# EAGLE board HotFireBoard (EAGLE 9.0.1), part 1 of 2
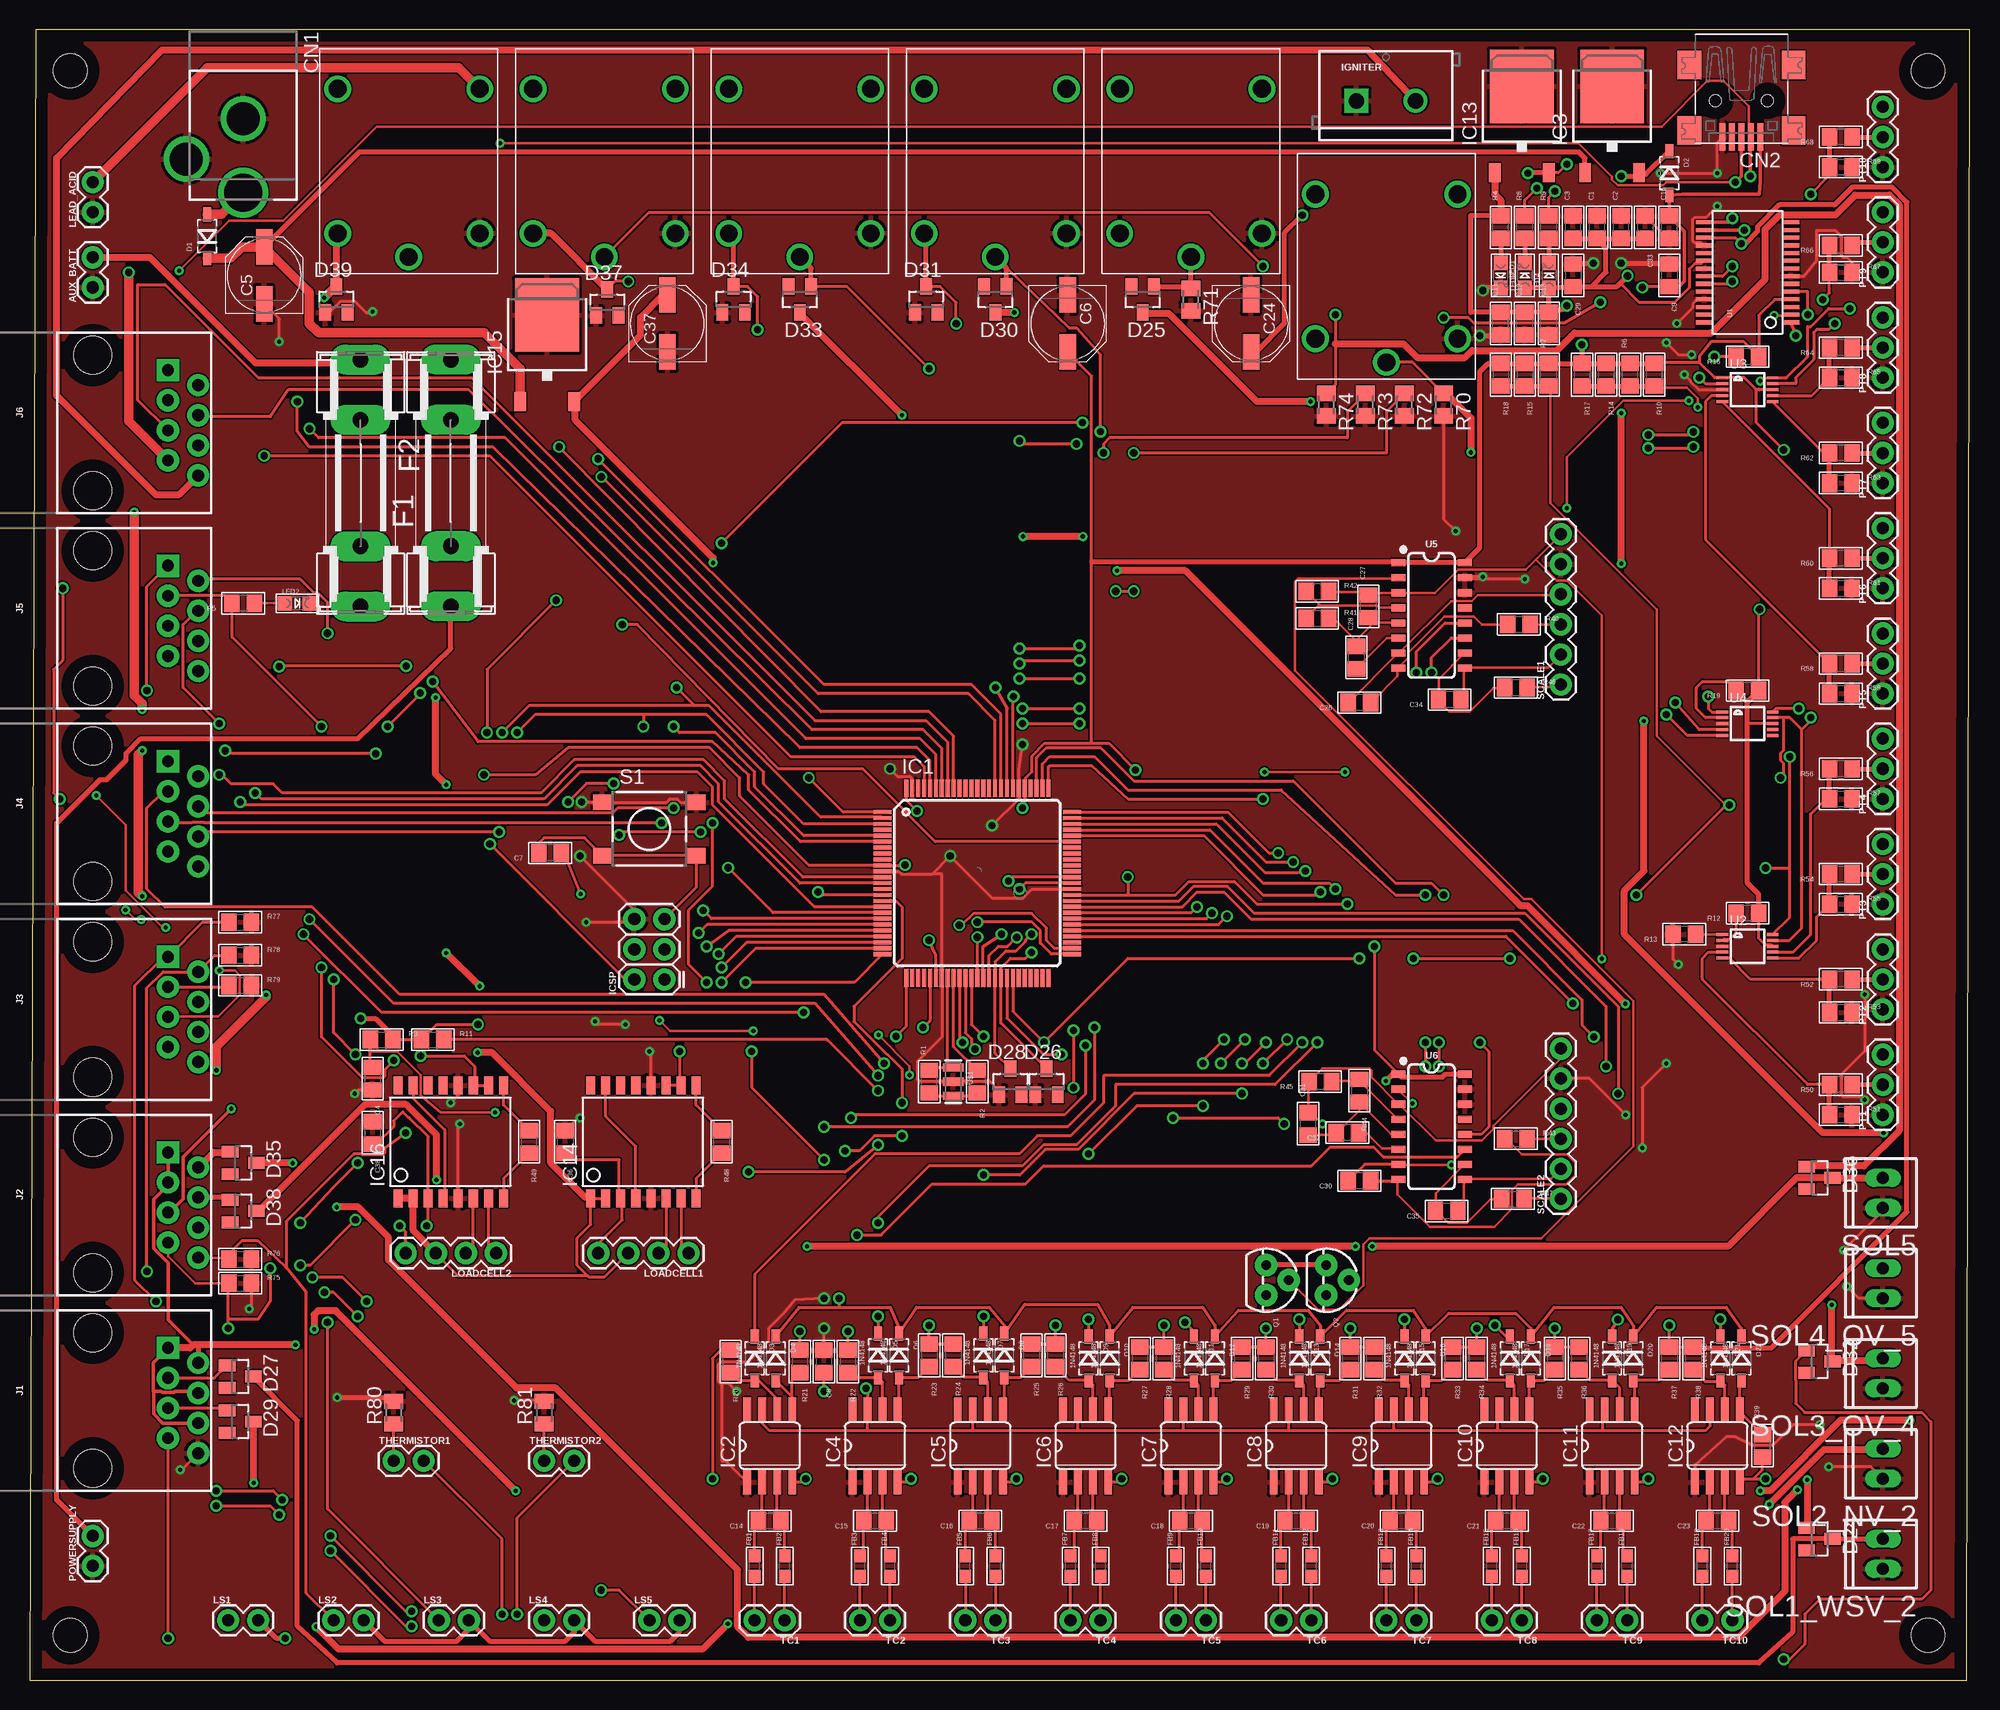
[diagram p2: board, top side]
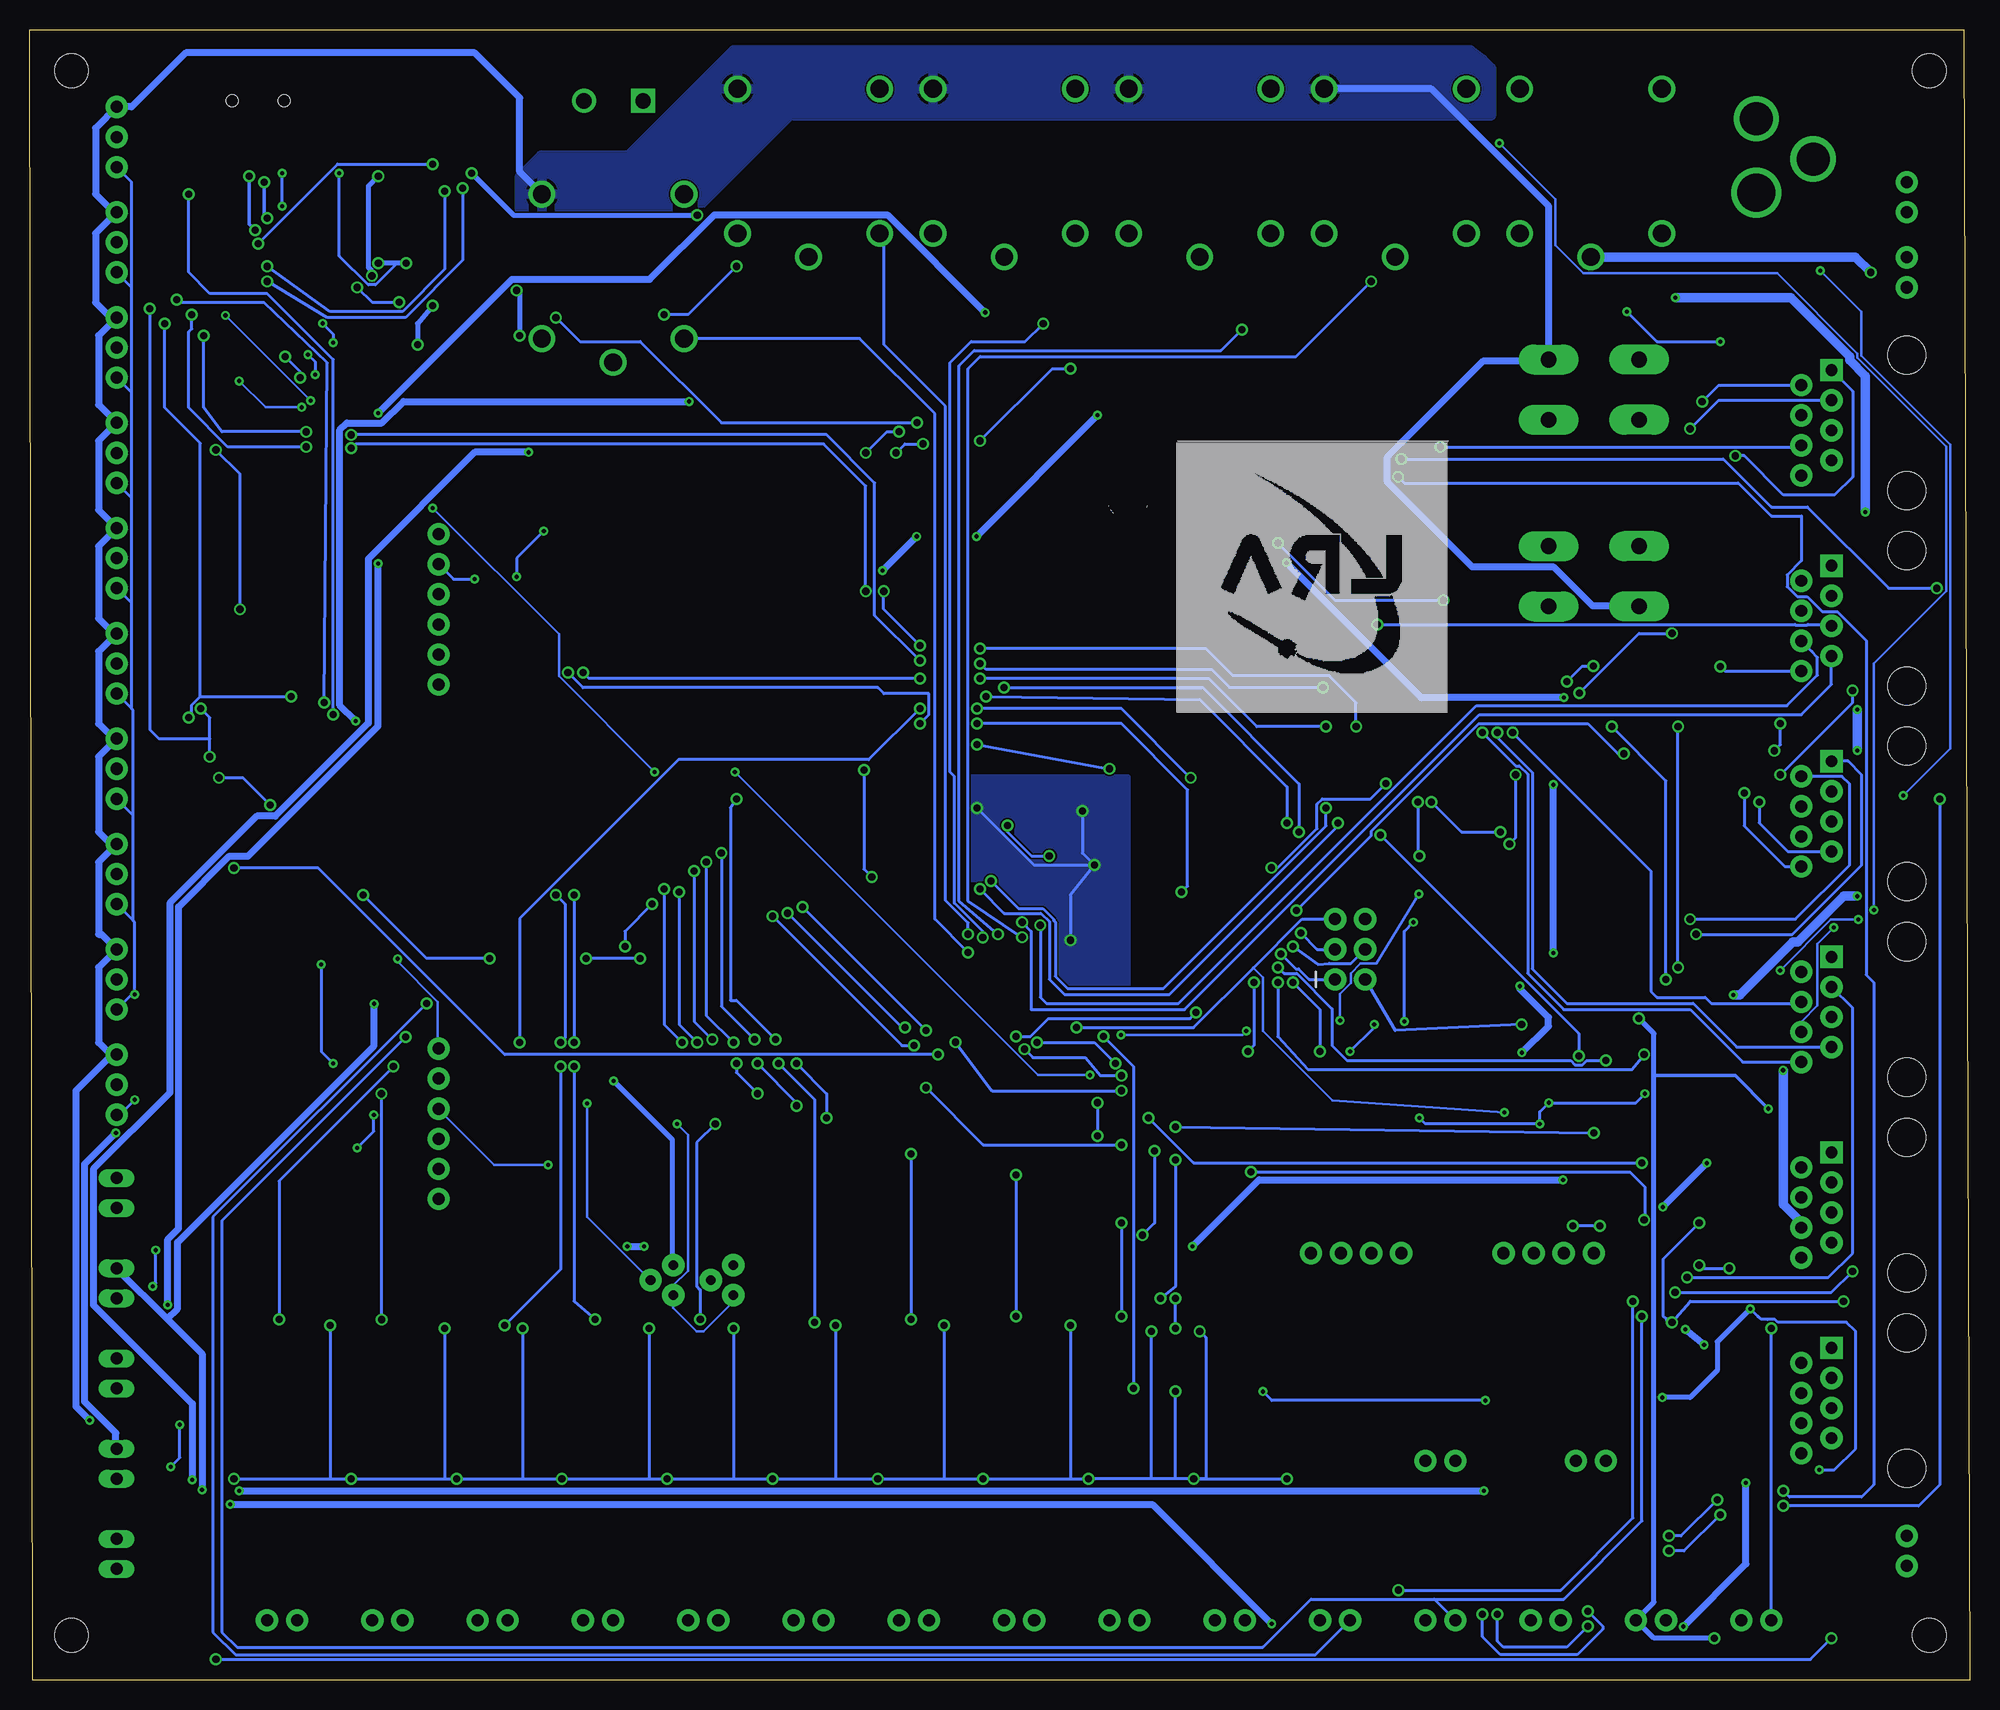
[diagram p3: board, bottom side, seen from below]

Size 163.81 x 139.37 mm. Coordinates in mm from the lower left corner, seen from the top.
Outline: 0,0 163.56,0 163.81,139.37 0.51,139.37 0,0
Copper layers (1*16): Top 0.035mm / dielectric 1.5mm / Bottom 0.035mm
Design rules "default *": minimum track width 5mil, minimum drill 0.2mm, track to track 5mil, track to pad 5mil, pad to pad 5mil, via to via 5mil, smd to smd 5mil, copper to edge 40mil, drill to drill 6mil, minimum pad ring 10mil, minimum via ring 8mil, stop-mask expansion 4mil, vias tented up to drill 0mil, thermal gap 10mil
Net classes: 0 default: width 0.203 mm, drill 0.254 mm, clearance 0.127 mm; 1 16mil: width 0.254 mm, drill 0.254 mm, clearance 0.127 mm; 2 24mil: width 0.254 mm, drill 0.254 mm, clearance 0.127 mm; 3 32mil: width 0.254 mm, drill 0.254 mm, clearance 0.127 mm
Holes 2.84 mm at 3.43,135.89 3.43,3.81 160.27,3.81 160.27,135.89

## Footprints (pad centres in the part's own frame; a part is rotated, then mirrored left to right if it is on the bottom)
1X02 = drill 1.016 pad 1.88: 1 0,0; 2 2.54,0
0805 = smd 1.3 x 1.5: 1 -0.95,0; 2 0.95,0
PANASONIC_D = smd 3 x 1.4: + 2.4,0; - -2.4,0
DCJACK_2MM_PTH = drill 2.8: GND 0,7.35; GNDBREAK 4.8,10.75 | drill 3.2: PWR 0,13.6
USB-MINIB = smd 0.5 x 2.308: D+ 0,4.064; D- -0.8,4.064; GND 1.6,4.064; ID 0.8,4.064; VBUS -1.6,4.064 | smd 2 x 2.4: GND1 -4.4,-2; GND2 -4.4,3.5; GND3 4.4,3.5; GND4 4.4,-2 | hole 1: -2.2,1; 2.2,1
SOD-123 = smd 1.2 x 0.7: A 1.85,0; C -1.85,0
SOT23 = smd 1 x 1.4: 1 -0.95,-1.1; 2 0.95,-1.1; 3 0,1.1
SHK20L = drill 1.321 pad 2.54 long: 1A -10.414,0; 1B -5.334,0; 2A 10.414,0; 2B 5.334,0
0603 = smd 1.1 x 1: 1 -0.85,0; 2 0.85,0
TQFP100 = smd 1.5 x 0.35: 1 -8,6; 2 -8,5.5; 3 -8,5; 4 -8,4.5; 5 -8,4; 6 -8,3.5; 7 -8,3; 8 -8,2.5; 9 -8,2; 10 -8,1.5; 11 -8,1; 12 -8,0.5; 13 -8,0; 14 -8,-0.5; 15 -8,-1; 16 -8,-1.5; 17 -8,-2; 18 -8,-2.5; 19 -8,-3; 20 -8,-3.5; 21 -8,-4; 22 -8,-4.5; 23 -8,-5; 24 -8,-5.5; 25 -8,-6; 51 8,-6; 52 8,-5.5; 53 8,-5; 54 8,-4.5; 55 8,-4; 56 8,-3.5; 57 8,-3; 58 8,-2.5; 59 8,-2; 60 8,-1.5; 61 8,-1; 62 8,-0.5; 63 8,0; 64 8,0.5; 65 8,1; 66 8,1.5; 67 8,2; 68 8,2.5; 69 8,3; 70 8,3.5; 71 8,4; 72 8,4.5; 73 8,5; 74 8,5.5; 75 8,6 | smd 0.35 x 1.5: 26 -6,-8; 27 -5.5,-8; 28 -5,-8; 29 -4.5,-8; 30 -4,-8; 31 -3.5,-8; 32 -3,-8; 33 -2.5,-8; 34 -2,-8; 35 -1.5,-8; 36 -1,-8; 37 -0.5,-8; 38 0,-8; 39 0.5,-8; 40 1,-8; 41 1.5,-8; 42 2,-8; 43 2.5,-8; 44 3,-8; 45 3.5,-8; 46 4,-8; 47 4.5,-8; 48 5,-8; 49 5.5,-8; 50 6,-8; 76 6,8; 77 5.5,8; 78 5,8; 79 4.5,8; 80 4,8; 81 3.5,8; 82 3,8; 83 2.5,8; 84 2,8; 85 1.5,8; 86 1,8; 87 0.5,8; 88 0,8; 89 -0.5,8; 90 -1,8; 91 -1.5,8; 92 -2,8; 93 -2.5,8; 94 -3,8; 95 -3.5,8; 96 -4,8; 97 -4.5,8; 98 -5,8; 99 -5.5,8; 100 -6,8
SO08 = smd 0.66 x 2.032: 1 -1.905,-3.073; 2 -0.635,-3.073; 3 0.635,-3.073; 4 1.905,-3.073; 5 1.905,3.073; 6 0.635,3.073; 7 -0.635,3.073; 8 -1.905,3.073
TO252 = smd 1 x 1.6: 1 -2.28,-4.8; 2 2.28,-4.8 | smd 5.4 x 6.2: 3 0,2.5
SO16-1 = smd 0.762 x 1.524: 1 -4.445,-4.775; 2 -3.175,-4.775; 3 -1.905,-4.775; 4 -0.635,-4.775; 5 0.635,-4.775; 6 1.905,-4.775; 7 3.175,-4.775; 8 4.445,-4.775; 9 4.445,4.775; 10 3.175,4.775; 11 1.905,4.775; 12 0.635,4.775; 13 -0.635,4.775; 14 -1.905,4.775; 15 -3.175,4.775; 16 -4.445,4.775
2X3 = drill 1.016 pad 1.88: 1 0,0; 2 0,2.54; 3 2.54,0; 4 2.54,2.54; 5 5.08,0; 6 5.08,2.54
SCREWTERMINAL-5MM-2 = drill 1.3 pad 2.032 square: 1 0,0 | drill 1.3 pad 2.032: 2 5,0
RJ45-8 = drill 1 pad 1.88 square: 1 -4.445,6.35 | drill 1 pad 1.88: 2 -3.175,8.89; 3 -1.905,6.35; 4 -0.635,8.89; 5 0.635,6.35; 6 1.905,8.89; 7 3.175,6.35; 8 4.445,8.89 | hole 3.2: -5.715,0; 5.715,0
CHIPLED_0805 = smd 1.2 x 1.2: A 0,-1.05; C 0,1.05
1X04 = drill 1.016 pad 1.88: 1 0,0; 2 2.54,0; 3 5.08,0; 4 7.62,0
1X03 = drill 1.016 pad 1.88: 1 0,0; 2 2.54,0; 3 5.08,0
TO-92 = drill 0.813 pad 1.88: 1 -1.27,0; 2 0,1.905; 3 1.27,0
M0805 = smd 1.3 x 1.6: 1 -0.95,0; 2 0.95,0
DTSM-6 = smd 1.55 x 1.3: 1 -3.975,2.25; 2 3.975,2.25; 3 -3.975,-2.25; 4 3.975,-2.25
1X06 = drill 1.016 pad 1.88: 1 0,0; 2 2.54,0; 3 5.08,0; 4 7.62,0; 5 10.16,0; 6 12.7,0
MTA-100-2V = drill 1.016 long: 1 -1.27,0; 2 1.27,0
SSOP28DB = smd 0.348 x 1.397: 1 -4.225,-3.656; 2 -3.575,-3.656; 3 -2.925,-3.656; 4 -2.275,-3.656; 5 -1.625,-3.656; 6 -0.975,-3.656; 7 -0.325,-3.656; 8 0.325,-3.656; 9 0.975,-3.656; 10 1.625,-3.656; 11 2.275,-3.656; 12 2.925,-3.656; 13 3.575,-3.656; 14 4.225,-3.656; 15 4.225,3.656; 16 3.575,3.656; 17 2.925,3.656; 18 2.275,3.656; 19 1.625,3.656; 20 0.975,3.656; 21 0.325,3.656; 22 -0.325,3.656; 23 -0.975,3.656; 24 -1.625,3.656; 25 -2.275,3.656; 26 -2.925,3.656; 27 -3.575,3.656; 28 -4.225,3.656
MSOP10 = smd 0.25 x 1: 1 -1,-2.113; 2 -0.5,-2.113; 3 0,-2.113; 4 0.5,-2.113; 5 1,-2.113; 6 1,2.113; 7 0.5,2.113; 8 0,2.113; 9 -0.5,2.113; 10 -1,2.113
SO16 = smd 0.6 x 1.2: 1 -4.445,-2.8; 2 -3.175,-2.8; 3 -1.905,-2.8; 4 -0.635,-2.8; 5 0.635,-2.8; 6 1.905,-2.8; 7 3.175,-2.8; 8 4.445,-2.8; 9 4.445,2.8; 10 3.175,2.8; 11 1.905,2.8; 12 0.635,2.8; 13 -0.635,2.8; 14 -1.905,2.8; 15 -3.175,2.8; 16 -4.445,2.8
RESONATOR-SMD = smd 0.7 x 1.7: 1 -1.2,0; 2 0,0; 3 1.2,0
RW-SH = drill 1.5: 1 -6.1,6; 2 -6.1,-6; COM -8.1,0; NC 6.1,6; NO 6.1,-6

## Placement (x,y rotation side)
AUX_BATT  [1X02]  5.33,117.6 90 top
C1  0.1uF  [0805]  132.33,122.68 90 top
C2  0.1uF  [0805]  134.37,122.68 90 top
C3  0.1uF  [0805]  130.3,122.68 90 top
C4  22pF  [0805]  28.96,50.8 270 top
C5  47uF  [PANASONIC_D]  19.81,118.62 90 top
C6  47uF  [PANASONIC_D]  87.63,114.55 270 top
C7  0.1uF  [0805]  43.94,69.85 180 top
C8  0.1uF  [0805]  67.06,26.92 270 top
C9  4.7uF  [0805]  138.43,118.62 270 top
C10  0.1uF  [0805]  138.43,122.68 90 top
C11  0.1uF  [0805]  124.21,114.55 90 top
C12  0.1uF  [0805]  126.24,114.55 90 top
C13  0.1uF  [0805]  128.27,114.55 90 top
C14  0.01uF  [0805]  62.48,13.46 180 top
C15  0.01uF  [0805]  71.37,13.46 180 top
C16  0.01uF  [0805]  80.26,13.46 180 top
C17  0.01uF  [0805]  89.15,13.46 180 top
C18  0.01uF  [0805]  98.04,13.46 180 top
C19  0.01uF  [0805]  106.93,13.46 180 top
C20  0.01uF  [0805]  115.82,13.46 180 top
C21  0.01uF  [0805]  124.71,13.46 180 top
C22  0.01uF  [0805]  133.6,13.46 180 top
C23  0.01uF  [0805]  142.49,13.46 180 top
C24  47uF  [PANASONIC_D]  103.12,114.55 270 top
C26  0.1uF  [0805]  112.27,82.55 180 top
C27  1uF  [0805]  113.03,90.68 90 top
C28  1uF  [0805]  112.01,86.36 90 top
C29  1uF  [0805]  130.3,118.62 270 top
C30  0.1uF  [0805]  112.27,42.16 180 top
C31  1uF  [0805]  107.95,46.99 90 top
C32  1uF  [0805]  111.25,46.23 180 top
C33  1uF  [0805]  136.4,122.68 270 top
C34  0.1uF  [0805]  119.89,82.8 180 top
C35  0.1uF  [0805]  119.63,39.62 180 top
C36  0.1uF  [0805]  45.21,45.47 270 top
C37  47uF  [PANASONIC_D]  53.85,114.55 90 top
C38  0.1uF  [0805]  28.96,46.23 270 top
CN1  [DCJACK_2MM_PTH]  18.03,139.19 180 top
CN2  [USB-MINIB]  144.53,134.37 180 top
D1  [SOD-123]  14.99,121.92 90 top
D2  [SOD-123]  138.43,127.25 270 top
D3  1N4148  [SOD-123]  61.21,27.18 270 top
D4  1N4148  [SOD-123]  62.99,27.18 270 top
D5  1N4148  [SOD-123]  71.63,27.43 270 top
D6  1N4148  [SOD-123]  73.41,27.43 270 top
D7  1N4148  [SOD-123]  80.52,27.43 270 top
D8  1N4148  [SOD-123]  82.3,27.43 270 top
D9  1N4148  [SOD-123]  89.41,27.18 270 top
D10  1N4148  [SOD-123]  91.19,27.18 270 top
D11  1N4148  [SOD-123]  98.3,27.18 270 top
D12  1N4148  [SOD-123]  100.08,27.18 270 top
D13  1N4148  [SOD-123]  107.19,27.18 270 top
D14  1N4148  [SOD-123]  108.97,27.18 270 top
D15  1N4148  [SOD-123]  116.08,27.18 270 top
D16  1N4148  [SOD-123]  117.86,27.18 270 top
D17  1N4148  [SOD-123]  124.97,27.18 270 top
D18  1N4148  [SOD-123]  126.75,27.18 270 top
D19  1N4148  [SOD-123]  133.6,27.18 270 top
D20  1N4148  [SOD-123]  135.38,27.18 270 top
D21  1N4148  [SOD-123]  142.75,27.18 270 top
D22  1N4148  [SOD-123]  144.53,27.18 270 top
D24  BAS40  [SOT23]  151.13,11.94 270 top
D25  BAS40  [SOT23]  93.98,116.59 180 top
D26  BAS40  [SOT23]  85.85,50.55 0 top
D27  BAS40  [SOT23]  17.78,25.65 270 top
D28  BAS40  [SOT23]  82.8,50.55 0 top
D29  BAS40  [SOT23]  17.78,21.84 270 top
D30  BAS40  [SOT23]  81.53,116.59 180 top
D31  BAS40  [SOT23]  75.69,116.59 0 top
D32  BAS40  [SOT23]  151.13,26.92 270 top
D33  BAS40  [SOT23]  65.02,116.59 180 top
D34  BAS40  [SOT23]  59.44,116.59 0 top
D35  BAS40  [SOT23]  18.03,43.69 270 top
D36  BAS40  [SOT23]  151.13,42.42 270 top
D37  BAS40  [SOT23]  48.77,116.33 0 top
D38  BAS40  [SOT23]  18.03,39.62 270 top
D39  BAS40  [SOT23]  25.91,116.59 0 top
F1  [SHK20L]  35.56,101.09 90 top
F2  [SHK20L]  27.94,101.09 270 top
FB1  [0603]  61.21,9.65 90 top
FB2  [0603]  63.75,9.65 90 top
FB3  [0603]  70.1,9.65 90 top
FB4  [0603]  72.64,9.65 90 top
FB5  [0603]  78.99,9.65 90 top
FB6  [0603]  81.53,9.65 90 top
FB7  [0603]  87.88,9.65 90 top
FB8  [0603]  90.42,9.65 90 top
FB9  [0603]  96.77,9.65 90 top
FB10  [0603]  99.31,9.65 90 top
FB11  [0603]  105.66,9.65 90 top
FB12  [0603]  108.2,9.65 90 top
FB13  [0603]  114.55,9.65 90 top
FB14  [0603]  117.09,9.65 90 top
FB15  [0603]  123.44,9.65 90 top
FB16  [0603]  125.98,9.65 90 top
FB17  [0603]  132.33,9.65 90 top
FB18  [0603]  134.87,9.65 90 top
FB19  [0603]  141.22,9.65 90 top
FB20  [0603]  143.76,9.65 90 top
IC1  ATMEGA640-16AI  [TQFP100]  80.01,67.31 0 top
IC2  MAX31855  [SO08]  62.48,19.81 0 top
IC3  7806DT  [TO252]  133.6,132.08 0 top
IC4  MAX31855  [SO08]  71.37,19.81 0 top
IC5  MAX31855  [SO08]  80.26,19.81 0 top
IC6  MAX31855  [SO08]  89.15,19.81 0 top
IC7  MAX31855  [SO08]  98.04,19.81 0 top
IC8  MAX31855  [SO08]  106.93,19.81 0 top
IC9  MAX31855  [SO08]  115.82,19.81 0 top
IC10  MAX31855  [SO08]  124.71,19.81 0 top
IC11  MAX31855  [SO08]  133.6,19.81 0 top
IC12  MAX31855  [SO08]  142.49,19.81 0 top
IC13  7806DT  [TO252]  125.98,132.08 0 top
IC14  INA125U  [SO16-1]  51.82,45.47 0 top
IC15  7806DT  [TO252]  43.69,112.78 0 top
IC16  INA125U  [SO16-1]  35.56,45.47 0 top
ICSP  FEMALE 2x3  [2X3]  53.59,59.18 90 top
IGNITER  [SCREWTERMINAL-5MM-2]  112.01,133.35 0 top
J1  RJ45  [RJ45-8]  5.33,23.62 270 top
J2  RJ45  [RJ45-8]  5.33,40.13 270 top
J3  RJ45  [RJ45-8]  5.33,56.64 270 top
J4  RJ45  [RJ45-8]  5.33,73.15 270 top
J5  RJ45  [RJ45-8]  5.33,89.66 270 top
J6  RJ45  [RJ45-8]  5.33,106.17 270 top
LEAD_ACID  [1X02]  5.33,123.95 90 top
LED1  GREEN  [CHIPLED_0805]  124.21,118.62 180 top
LED2  YELLOW  [CHIPLED_0805]  22.61,90.93 270 top
LED3  BLUE  [CHIPLED_0805]  126.24,118.62 0 top
LED4  RED  [CHIPLED_0805]  128.27,118.62 0 top
LOADCELL1  [1X04]  55.63,36.07 180 top
LOADCELL2  [1X04]  39.37,36.07 180 top
LS1  [1X02]  16.76,5.08 0 top
LS2  [1X02]  25.65,5.08 0 top
LS3  [1X02]  34.54,5.08 0 top
LS4  [1X02]  43.43,5.08 0 top
LS5  [1X02]  52.32,5.08 0 top
POWERSUPPLY  [1X02]  5.33,9.65 90 top
PT1  [1X03]  156.46,47.75 90 top
PT2  [1X03]  156.46,56.64 90 top
PT3  [1X03]  156.46,65.53 90 top
PT4  [1X03]  156.46,74.42 90 top
PT5  [1X03]  156.46,83.31 90 top
PT6  [1X03]  156.46,92.2 90 top
PT7  [1X03]  156.46,101.09 90 top
PT8  [1X03]  156.46,109.98 90 top
PT9  [1X03]  156.46,118.87 90 top
PT10  [1X03]  156.46,127.76 90 top
Q1  s8550  [TO-92]  104.39,33.78 270 top
Q2  s8550  [TO-92]  109.47,33.78 270 top
R1  1m  [0805]  75.95,50.55 90 top
R2  27  [0805]  80.01,50.55 270 top
R3  10k  [0805]  29.72,54.1 0 top
R4  1k  [0805]  124.21,122.68 90 top
R5  1k  [0805]  18.03,90.93 180 top
R6  10k  [0805]  135.13,110.24 90 top
R7  10k  [0805]  128.27,110.24 90 top
R8  680  [0805]  126.24,122.68 90 top
R9  680  [0805]  128.27,122.68 90 top
R10  10k  [0805]  137.16,110.24 270 top
R11  10k  [0805]  34.04,54.1 0 top
R12  10k  [0805]  145.03,64.77 180 top
R13  10k  [0805]  139.7,62.99 180 top
R14  10k  [0805]  133.1,110.24 270 top
R15  10k  [0805]  126.24,110.24 270 top
R16  10k  [0805]  145.03,111.76 180 top
R17  10k  [0805]  131.06,110.24 270 top
R18  10k  [0805]  124.21,110.24 270 top
R19  10k  [0805]  145.03,83.57 180 top
R20  10k  [0805]  59.18,26.92 270 top
R21  10k  [0805]  65.02,26.92 270 top
R22  10k  [0805]  69.09,26.92 270 top
R23  10k  [0805]  75.95,27.43 270 top
R24  10k  [0805]  77.98,27.43 270 top
R25  10k  [0805]  84.58,27.43 270 top
R26  10k  [0805]  86.61,27.43 270 top
R27  10k  [0805]  93.73,27.18 270 top
R28  10k  [0805]  95.76,27.18 270 top
R29  10k  [0805]  102.36,27.18 270 top
R30  10k  [0805]  104.39,27.18 270 top
R31  10k  [0805]  111.51,27.18 270 top
R32  10k  [0805]  113.54,27.18 270 top
R33  10k  [0805]  120.14,27.18 270 top
R34  10k  [0805]  122.17,27.18 270 top
R35  10k  [0805]  128.78,27.18 270 top
R36  10k  [0805]  130.81,27.18 270 top
R37  10k  [0805]  138.43,27.18 270 top
R38  10k  [0805]  140.46,27.18 270 top
R39  10k  [0805]  146.3,19.81 90 top
R40  1k  [0805]  125.73,89.15 0 top
R41  8.2k  [0805]  108.71,89.66 0 top
R42  20k  [0805]  108.71,91.95 0 top
R43  1k  [0805]  125.48,45.72 0 top
R44  8.2k  [0805]  112.27,49.78 270 top
R45  20k  [0805]  108.97,50.55 180 top
R46  1k  [0805]  125.48,83.82 0 top
R47  1k  [0805]  125.22,40.64 0 top
R48  15  [0805]  58.42,45.47 270 top
R49  15  [0805]  42.16,45.47 270 top
R50  3.8k  [0805]  152.91,50.29 180 top
R51  1k  [0805]  152.91,47.75 0 top
R52  3.8k  [0805]  152.91,59.18 180 top
R53  1k  [0805]  152.91,56.39 0 top
R54  3.8k  [0805]  152.91,68.07 180 top
R55  1k  [0805]  152.91,65.53 0 top
R56  3.8k  [0805]  152.91,76.96 180 top
R57  1k  [0805]  152.91,74.42 0 top
R58  3.8k  [0805]  152.91,85.85 180 top
R59  1k  [0805]  152.91,83.31 0 top
R60  3.8k  [0805]  152.91,94.74 180 top
R61  1k  [0805]  152.91,92.2 0 top
R62  3.8k  [0805]  152.91,103.63 180 top
R63  1k  [0805]  152.91,101.09 0 top
R64  3.8k  [0805]  152.91,112.52 180 top
R65  1k  [0805]  152.91,109.98 0 top
R66  3.8k  [0805]  152.91,121.16 180 top
R67  1k  [0805]  152.91,118.87 0 top
R68  3.8k  [0805]  152.91,130.3 180 top
R69  1k  [0805]  152.91,127.76 0 top
R70  10K  [M0805]  119.38,107.7 270 top
R71  10K  [M0805]  98.04,116.59 270 top
R72  10K  [M0805]  116.08,107.7 270 top
R73  10K  [M0805]  112.78,107.7 270 top
R74  10K  [M0805]  109.47,107.7 270 top
R75  10k  [0805]  17.78,33.53 0 top
R76  10k  [0805]  17.78,35.56 0 top
R77  10k  [0805]  17.78,64.01 0 top
R78  10k  [0805]  17.78,61.21 0 top
R79  10k  [0805]  17.78,58.67 0 top
R80  10K  [M0805]  30.73,22.61 90 top
R81  10K  [M0805]  43.43,22.61 90 top
S1  DTSM-6  [DTSM-6]  52.32,71.88 0 top
SCALE1  [1X06]  129.29,84.07 90 top
SCALE2  [1X06]  129.29,40.64 90 top
SOL1_WSV_2  [MTA-100-2V]  156.46,10.67 90 top
SOL2_NV_2  [MTA-100-2V]  156.46,18.29 90 top
SOL3_OV_4  [MTA-100-2V]  156.46,25.91 90 top
SOL4_OV_5  [MTA-100-2V]  156.46,33.53 90 top
SOL5  [MTA-100-2V]  156.46,41.15 90 top
TC1  [1X02]  63.75,5.08 180 top
TC2  [1X02]  72.64,5.08 180 top
TC3  [1X02]  81.53,5.08 180 top
TC4  [1X02]  90.42,5.08 180 top
TC5  [1X02]  99.31,5.08 180 top
TC6  [1X02]  108.2,5.08 180 top
TC7  [1X02]  117.09,5.08 180 top
TC8  [1X02]  125.98,5.08 180 top
TC9  [1X02]  134.87,5.08 180 top
TC10  [1X02]  143.76,5.08 180 top
THERMISTOR1  [1X02]  30.73,18.54 0 top
THERMISTOR2  [1X02]  43.43,18.54 0 top
U1  [SSOP28DB]  145.03,118.87 90 top
U2  ADS1115IDGST  [MSOP10]  145.03,61.98 270 top
U3  ADS1115IDGST  [MSOP10]  145.03,108.97 270 top
U4  ADS1115IDGST  [MSOP10]  145.03,80.77 270 top
U5  HX711  [SO16]  118.36,89.92 270 top
U6  HX711  [SO16]  118.36,46.74 270 top
U$1  RESONATORSMD  [RESONATOR-SMD]  77.98,50.55 270 top
U$128  RW-SH  [RW-SH]  114.55,119.38 90 top
U$129  RW-SH  [RW-SH]  98.04,128.27 90 top
U$130  RW-SH  [RW-SH]  81.53,128.27 90 top
U$131  RW-SH  [RW-SH]  65.02,128.27 90 top
U$132  RW-SH  [RW-SH]  48.51,128.27 90 top
U$138  RW-SH  [RW-SH]  32,128.27 90 top